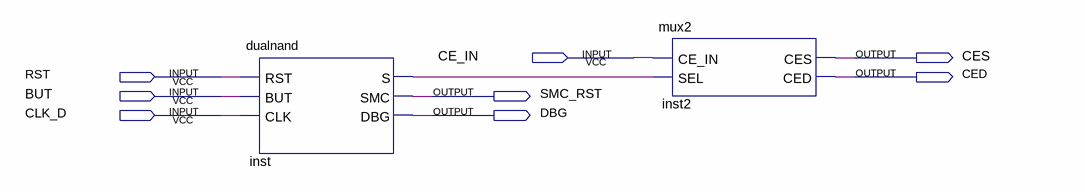
[diagram p0: schematic sheet]
// Quartus schematic mux_dual.bdf as structural Verilog: 2 symbols, 8 pins
module mux_dual (
  input  CE_IN,
  input  RST,
  input  BUT,
  input  CLK_D,
  output CES,
  output CED,
  output SMC_RST,
  output DBG
);

  wire inst_s;

  dualnand inst (.RST(RST), .BUT(BUT), .CLK(CLK_D), .S(inst_s), .SMC(SMC_RST), .DBG(DBG));
  mux2 inst2 (.CE_IN(CE_IN), .SEL(inst_s), .CES(CES), .CED(CED));
endmodule
